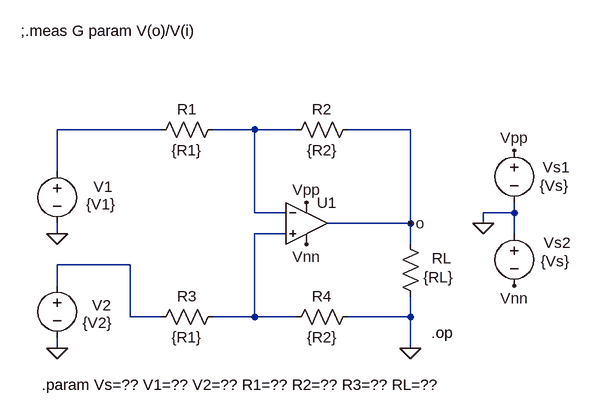
[diagram p0: schematic Amp04opFig.asc]
Amp04opFig.asc, the LTspice schematic file:
Version 4
SHEET 1 968 680
WIRE -64 80 -224 80
WIRE 80 80 16 80
WIRE 144 80 80 80
WIRE 320 80 224 80
WIRE -224 144 -224 80
WIRE 80 208 80 80
WIRE 128 208 80 208
WIRE 480 208 480 192
WIRE 480 208 432 208
WIRE 320 224 320 80
WIRE 320 224 192 224
WIRE 432 224 432 208
WIRE -224 240 -224 224
WIRE 128 240 80 240
WIRE 480 240 480 208
WIRE 320 256 320 224
WIRE -112 288 -224 288
WIRE -224 320 -224 288
WIRE -112 368 -112 288
WIRE -64 368 -112 368
WIRE 80 368 80 240
WIRE 80 368 16 368
WIRE 144 368 80 368
WIRE 320 368 320 336
WIRE 320 368 224 368
WIRE -224 416 -224 400
WIRE 320 416 320 368
FLAG 480 112 Vpp
FLAG 432 224 0
FLAG 480 320 Vnn
FLAG 320 416 0
FLAG -224 416 0
FLAG 160 192 Vpp
FLAG 160 256 Vnn
FLAG -224 240 0
FLAG 320 224 o
SYMBOL voltage 480 96 R0
WINDOW 123 0 0 Left 0
WINDOW 39 0 0 Left 0
WINDOW 0 44 42 Left 2
WINDOW 3 39 70 Left 2
SYMATTR InstName Vs1
SYMATTR Value {Vs}
SYMBOL voltage 480 224 R0
WINDOW 123 0 0 Left 0
WINDOW 39 0 0 Left 0
WINDOW 0 45 30 Left 2
WINDOW 3 41 58 Left 2
SYMATTR InstName Vs2
SYMATTR Value {Vs}
SYMBOL res 304 240 R0
WINDOW 0 49 38 Left 2
WINDOW 3 36 67 Left 2
SYMATTR InstName RL
SYMATTR Value {RL}
SYMBOL voltage -224 128 R0
WINDOW 3 45 67 Left 2
WINDOW 123 0 0 Left 0
WINDOW 39 0 0 Left 0
WINDOW 0 56 40 Left 2
SYMATTR Value {V1}
SYMATTR InstName V1
SYMBOL Opamps\\UniversalOpamp2 160 224 R0
SYMATTR InstName U1
SYMBOL res -80 96 R270
WINDOW 0 32 56 VTop 2
WINDOW 3 0 56 VBottom 2
SYMATTR InstName R1
SYMATTR Value {R1}
SYMBOL res 128 96 R270
WINDOW 0 32 56 VTop 2
WINDOW 3 0 56 VBottom 2
SYMATTR InstName R2
SYMATTR Value {R2}
SYMBOL voltage -224 304 R0
WINDOW 3 39 73 Left 2
WINDOW 123 0 0 Left 0
WINDOW 39 0 0 Left 0
WINDOW 0 54 46 Left 2
SYMATTR Value {V2}
SYMATTR InstName V2
SYMBOL res -80 384 R270
WINDOW 0 32 56 VTop 2
WINDOW 3 0 56 VBottom 2
SYMATTR InstName R3
SYMATTR Value {R1}
SYMBOL res 128 384 R270
WINDOW 0 32 56 VTop 2
WINDOW 3 0 56 VBottom 2
SYMATTR InstName R4
SYMATTR Value {R2}
TEXT -248 472 Left 2 !.param Vs=?? V1=?? V2=?? R1=?? R2=?? R3=?? RL=??
TEXT 352 392 Left 2 !.op
TEXT -280 -72 Left 2 !;.meas G param V(o)/V(i)

The netlist it stands for:
* Amp04opFig.asc
Vs1 Vpp 0 {Vs}
Vs2 0 Vnn {Vs}
RL o 0 {RL}
V1 N001 0 {V1}
XU1 N003 N002 Vpp Vnn o level.2 Avol=1Meg GBW=10Meg Slew=10Meg ilimit=25m rail=0 Vos=0 phimargin=45 en=0 enk=0 in=0 ink=0 Rin=500Meg  ; pins IN+ IN- V+ V- OUT
R1 N001 N002 {R1}
R2 N002 o {R2}
V2 N004 0 {V2}
R3 N004 N003 {R1}
R4 N003 0 {R2}
.param Vs=?? V1=?? V2=?? R1=?? R2=?? R3=?? RL=??
.op
;.meas G param V(o)/V(i)
.lib UniversalOpamps2.sub
.backanno
.end